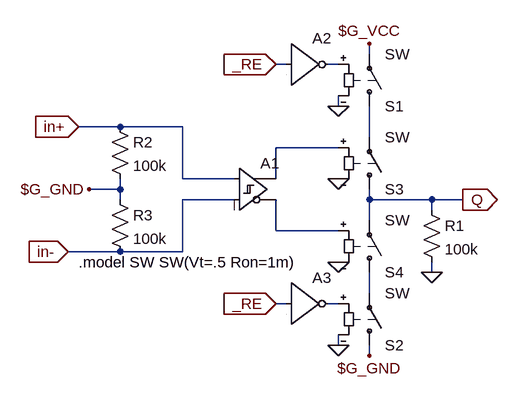
[diagram p0: schematic receiver.asc]
receiver.asc, the LTspice schematic file:
Version 4
SHEET 1 880 832
WIRE 208 -64 208 -80
WIRE 80 -48 64 -48
WIRE 160 -48 144 -48
WIRE 160 16 160 0
WIRE -176 48 -240 48
WIRE -80 48 -176 48
WIRE 208 64 208 16
WIRE 160 80 64 80
WIRE -80 128 -80 48
WIRE 0 128 -80 128
WIRE 64 128 64 80
WIRE -176 144 -176 128
WIRE -176 144 -224 144
WIRE -176 160 -176 144
WIRE 0 160 -80 160
WIRE 208 160 208 144
WIRE 304 160 208 160
WIRE 352 160 304 160
WIRE 304 176 304 160
WIRE 208 192 208 160
WIRE 64 208 64 160
WIRE 160 208 64 208
WIRE -176 240 -256 240
WIRE -80 240 -80 160
WIRE -80 240 -176 240
WIRE 304 272 304 256
WIRE 208 304 208 272
WIRE 80 320 64 320
WIRE 160 320 144 320
WIRE 160 384 160 368
WIRE 208 400 208 384
FLAG -240 48 in+
IOPIN -240 48 In
FLAG 352 160 Q
IOPIN 352 160 Out
FLAG 64 -48 _RE
IOPIN 64 -48 In
FLAG 208 -80 $G_VCC
FLAG 208 400 $G_GND
FLAG -256 240 in-
IOPIN -256 240 In
FLAG 160 16 0
FLAG 160 384 0
FLAG 64 320 _RE
IOPIN 64 320 In
FLAG 160 128 0
FLAG 160 256 0
FLAG 304 272 0
FLAG -224 144 $G_GND
SYMBOL sw 208 32 M180
SYMATTR InstName S1
SYMBOL sw 208 400 M180
SYMATTR InstName S2
SYMBOL Digital\\diffschmitt 0 80 R0
WINDOW 3 8 44 Invisible 2
SYMATTR Value VT=2
SYMATTR InstName A1
SYMBOL sw 208 160 M180
SYMATTR InstName S3
SYMBOL sw 208 288 M180
SYMATTR InstName S4
SYMBOL Digital\\inv 80 -112 R0
SYMATTR InstName A2
SYMBOL Digital\\inv 80 256 R0
SYMATTR InstName A3
SYMBOL res 288 160 R0
SYMATTR InstName R1
SYMATTR Value 100k
SYMBOL res -192 32 R0
SYMATTR InstName R2
SYMATTR Value 100k
SYMBOL res -192 144 R0
SYMATTR InstName R3
SYMATTR Value 100k
TEXT -240 256 Left 2 !.model SW SW(Vt=.5 Ron=1m)

The netlist it stands for:
* receiver.asc
S1 N002 $G_VCC N001 0 SW
S2 $G_GND N005 N006 0 SW
A1 in+ in- 0 0 0 N004 N003 0 SCHMITT VT=2
S3 Q N002 N003 0 SW
S4 N005 Q N004 0 SW
A2 _RE 0 0 0 0 N001 0 0 BUF
A3 _RE 0 0 0 0 N006 0 0 BUF
R1 Q 0 100k
R2 in+ $G_GND 100k
R3 $G_GND in- 100k
.model SW SW(Vt=.5 Ron=1m)
.backanno
.end